# Altium project ped.PrjPCB
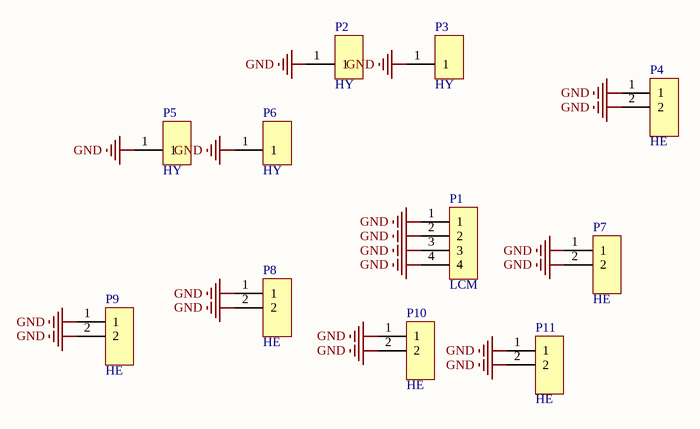
[diagram p0: ped.SchDoc]
1 sheet, 11 parts. Net scope: global (net labels, ports and power ports of the same name join across sheets).
Board file: ped.PcbDoc

## Sheet ped.SchDoc
size A4

### Parts
P1  LCM  [LCD_M]
P2  HY  [BNC_WE]
P3  HY  [BNC_WE]
P4  HE  [WK]
P5  HY  [BNC_M]
P6  HY  [BNC_M]
P7  HE  [WK]
P8  HE  [WK]
P9  HE  [WK]
P10  HE  [WK]
P11  HE  [WK]

### Nets
GND: P1.1 P1.2 P1.3 P1.4 P2.1 P3.1 P4.1 P4.2 P5.1 P6.1 P7.1 P7.2 P8.1 P8.2 P9.1 P9.2 P10.1 P10.2 P11.1 P11.2

### Library data of the parts
P1 = Component_1